# EAGLE design bugfics_0.9 (EAGLE 9.6.2)
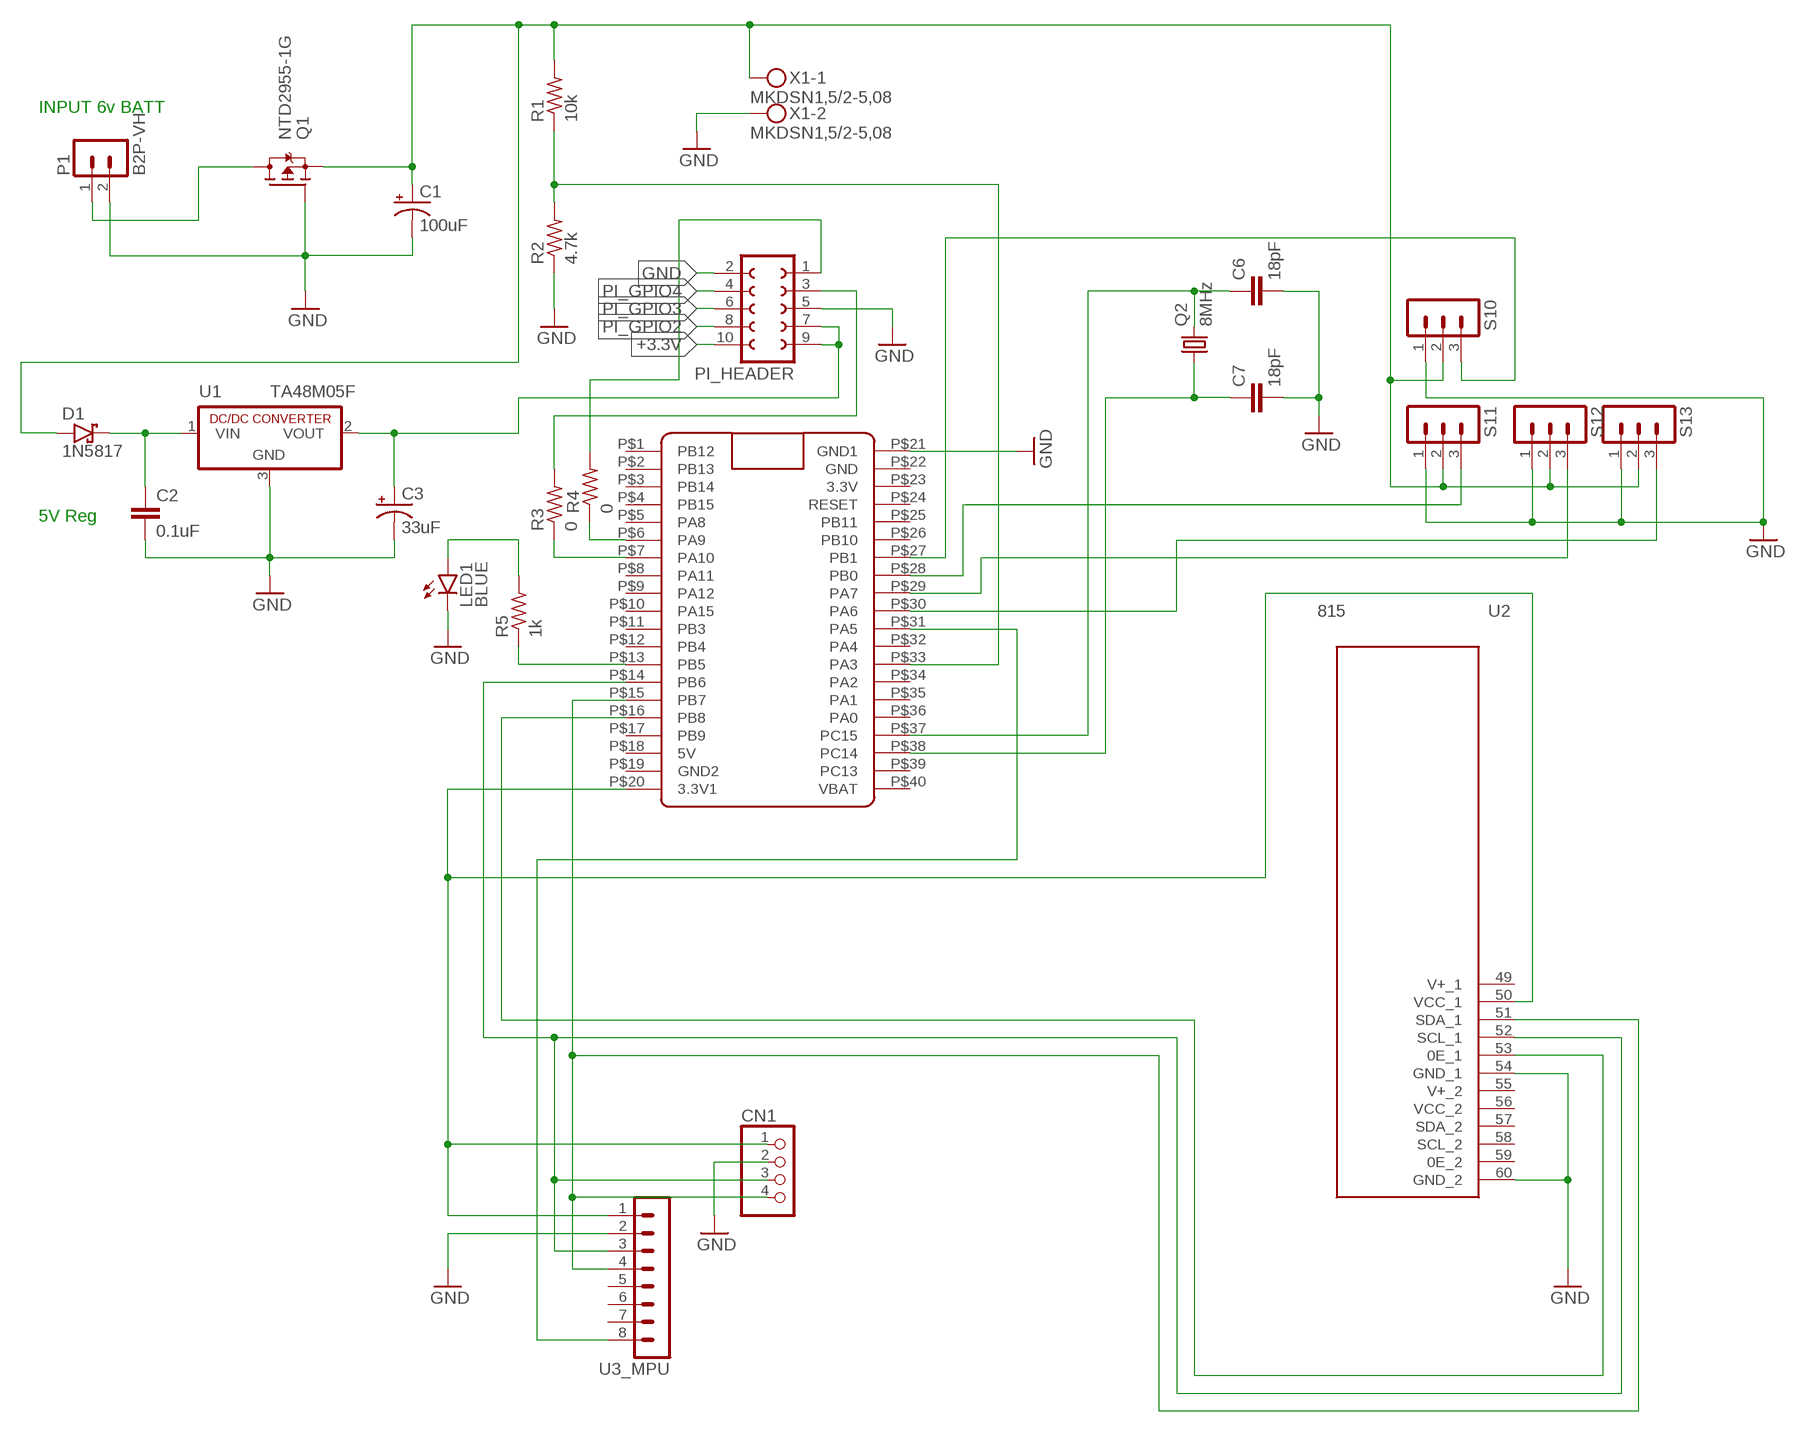
[diagram p0: schematic, sheet 1]

## Parts
C1  100uF  CPOL-USE2-5  [E2-5]
C2  0.1uF  C-EU025-025X050  [C025-025X050]
C3  33uF  CPOL-USE2-5  [E2-5]
C6  18pF  C-EU050-025X075  [C050-025X075]
C7  18pF  C-EU050-025X075  [C050-025X075]
CN1  PINHD-1X4  [1X04]
D1  1N5817  [DO41-3]
LED1  BLUE  LED3MM  [LED3MM]
P1  B2P-VH  [B2P-VH]
PI_HEADER  FE05-2W  [FE05-2W]
Q1  NTD2955-1G  [IPAK_CASE_369D]
Q2  8MHz  CRYSTALHC49S  [HC49/S]
R1  10k  R-US_0207/7  [0207/7]
R2  4.7k  R-US_0207/7  [0207/7]
R3  0  R-US_0207/7  [0207/7]
R4  0  R-US_0207/7  [0207/7]
R5  1k  R-US_0207/7  [0207/7]
S10  MA03-1  [MA03-1]
S11  MA03-1  [MA03-1]
S12  MA03-1  [MA03-1]
S13  MA03-1  [MA03-1]
U1  TA48M05F  [TO252]
U2  815  [815]
U3_MPU  MA08-1  [MA08-1]
U$1  BLUE_PILL  [BLUE_PILL]
X1  MKDSN1,5/2-5,08  [MKDSN1,5/2-5,08]

## Nets
+3.3V [VCC]: PI_HEADER.10
GND [GND]: C1.- C2.2 C3.- C6.2 C7.2 CN1.2 LED1.K(C) P1.2 PI_HEADER.2 PI_HEADER.5 Q1.G R2.1 S10.1 S11.1 S12.1 S13.1 U1.3(GND) U2.54(GND_1) U2.60(GND_2) U3_MPU.2 U$1.P$21(GND1) X1.2
N$2: R3.1 U$1.P$7(PA10)
N$3 [VCC]: P1.1 Q1.D
N$4 [VCC]: C1.+ D1.A Q1.S R1.2 S10.2 S11.2 S12.2 S13.2 X1.1
N$7: R1.1 R2.2 U$1.P$33(PA3)
N$8 [VCC]: C2.1 D1.C U1.1(VIN)
N$9: S13.3 U$1.P$30(PA6)
N$10: S12.3 U$1.P$29(PA7)
N$11: S11.3 U$1.P$28(PB0)
N$12: S10.3 U$1.P$27(PB1)
N$14 [VCC]: CN1.1 U2.50(VCC_1) U3_MPU.1 U$1.P$20(3.3V1)
N$15: PI_HEADER.3 R3.2
N$16 [VCC]: C3.+ PI_HEADER.7 PI_HEADER.9 U1.2(VOUT)
N$17: PI_HEADER.1 R4.2
N$18: R4.1 U$1.P$6(PA9)
N$19: C6.1 Q2.2 U$1.P$37(PC15)
N$20: C7.1 Q2.1 U$1.P$38(PC14)
N$21: CN1.4 U2.51(SDA_1) U3_MPU.4 U$1.P$15(PB7)
N$22: CN1.3 U2.52(SCL_1) U3_MPU.3 U$1.P$14(PB6)
N$23: U2.53(0E_1) U$1.P$16(PB8)
N$24: U3_MPU.8 U$1.P$31(PA5)
N$25: R5.1 U$1.P$13(PB5)
N$27: LED1.A R5.2
PI_GPIO2: PI_HEADER.8
PI_GPIO3: PI_HEADER.6
PI_GPIO4: PI_HEADER.4
Unconnected: U2.49(V+_1) U2.55(V+_2) U2.56(VCC_2) U2.57(SDA_2) U2.58(SCL_2) U2.59(0E_2) U3_MPU.5 U3_MPU.6 U3_MPU.7 U$1.P$1(PB12) U$1.P$2(PB13) U$1.P$3(PB14) U$1.P$4(PB15) U$1.P$5(PA8) U$1.P$8(PA11) U$1.P$9(PA12) U$1.P$10(PA15) U$1.P$11(PB3) U$1.P$12(PB4) U$1.P$17(PB9) U$1.P$18(5V) U$1.P$19(GND2) U$1.P$22(GND) U$1.P$23(3.3V) U$1.P$24(RESET) U$1.P$25(PB11) U$1.P$26(PB10) U$1.P$32(PA4) U$1.P$34(PA2) U$1.P$35(PA1) U$1.P$36(PA0) U$1.P$39(PC13) U$1.P$40(VBAT)

## Notes on the sheet
- INPUT 6v BATT
- 5V Reg

## Library data of the parts
C1 C3 = rcl:CPOL-US: POLARIZED CAPACITOR, American symbol; SPICEPREFIX: C
C2 = rcl:C-EU: CAPACITOR, European symbol; SPICEPREFIX: C
C6 C7 = resistor:C-EU: CAPACITOR, European symbol
CN1 = pinhead:PINHD-1X4: PIN HEADER
D1 = 1N5817:1N5817: Check prices <https://pricing.snapeda.com/parts/1N5817/STMicroelectronics/view-part?ref=eda>; AVAILABILITY: In Stock; DESCRIPTION: 1N5817 Series Low Drop Power 1 A 0.45 V Schottky Rectifier Through Hole - DO-41; MF: STMicroelectronics; MP: 1N5817; PACKAGE: DO-41 STMicroelectronics; PRICE: None; PURCHASE-URL: https://pricing.snapeda.com/search/part/1N5817/?ref=eda
LED1 = led:LED: LED OSRAM: - CHIPLED LG R971, LG N971, LY N971, LG Q971, LY Q971, LO R971, LY R971 LH N974, LH R974 LS Q976, LO Q976, LY Q976 LO Q996 - Hyper CHIPLED LW Q18S LB Q993, LB Q99A, LB R99A - SideLED LS A670, LO A670, LY A670, LG A670, LP A670 LB A673, LV A673, LT A673, LW A673 LH A674 LY A675 LS A676, LA A676, LO A676, LY A676, LW A676 LS A679, LY A679, LG A679 - Hyper Micro SIDELED® LS Y876, LA Y876, LO Y876, LY Y876 LT Y87S - SmartLED LW L88C, LW L88S LB L89C, LB L89S, LG L890 LS L89K, LO L89K, LY L89K LS L896, LA L896, LO L896, LY L896 - TOPLED LS T670, LO T670, LY T670, LG T670, LP T670 LSG T670, LSP T670, LSY T670, LOP T670, LYG T670 LG T671, LOG T671, LSG T671 LB T673, LV T673, LT T673, LW T673 LH T674 LS T676, LA T676, LO T676, LY T676, LB T676, LH T676, LSB T676, LW T676 LB T67C, LV T67C, LT T67C, LS T67K, LO T67K, LY T67K, LW E67C LS E67B, LA E67B, LO E67B, LY E67B, LB E67C, LV E67C, LT E67C LW T67C LS T679, LY T679, LG T679 LS T770, LO T770, LY T770, LG T770, LP T770 LB T773, LV T773, LT T773, LW T773 LH T774 LS E675, LA E675, LY E675, LS T675 LS T776, LA T776, LO T776, LY T776, LB T776 LHGB T686 LT T68C, LB T68C - Hyper Mini TOPLED® LB M676 - Mini TOPLED Santana® LG M470 LS M47K, LO M47K, LY M47K Source: http://www.osram.convergy.de LUXEON: - LUMILED® LXK2-PW12-R00, LXK2-PW12-S00, LXK2-PW14-U00, LXK2-PW14-V00 LXK2-PM12-R00, LXK2-PM12-S00, LXK2-PM14-U00 LXK2-PE12-Q00, LXK2-PE12-R00, LXK2-PE12-S00, LXK2-PE14-T00, LXK2-PE14-U00 LXK2-PB12-K00, LXK2-PB12-L00, LXK2-PB12-M00, LXK2-PB14-N00, LXK2-PB14-P00, LXK2-PB14-Q00 LXK2-PR12-L00, LXK2-PR12-M00, LXK2-PR14-Q00, LXK2-PR14-R00 LXK2-PD12-Q00, LXK2-PD12-R00, LXK2-PD12-S00 LXK2-PH12-R00, LXK2-PH12-S00 LXK2-PL12-P00, LXK2-PL12-Q00, LXK2-PL12-R00 Source: www.luxeon.com KINGBRIGHT: KA-3528ASYC Source: www.kingbright.com
P1 = con-jst-vh:B2P-VH: HEADER
PI_HEADER = con-lsta:FE05-2W: FEMALE HEADER; OC_FARNELL: unknown; OC_NEWARK: unknown
Q1 = NTD2955-1G:NTD2955-1G: Check prices <https://pricing.snapeda.com/parts/NTD2955-1G/ON%20Semiconductor/view-part?ref=eda>; AVAILABILITY: In Stock; DESCRIPTION: P-Channel 60V 12A (Ta) 55W (Tj) Through Hole I-PAK; MF: ON Semiconductor; MP: NTD2955-1G; PACKAGE: TO-251 Fairchild Semiconductor; PRICE: None
Q2 = crystal:CRYSTAL: CRYSTAL; OC_FARNELL: 1667008; OC_NEWARK: unknown
R1-R5 = rcl:R-US_: RESISTOR, American symbol; SPICEPREFIX: R
S10-S13 = con-lstb:MA03-1: PIN HEADER; OC_FARNELL: unknown; OC_NEWARK: unknown
U1 = TA48M05F:TA48M05F
U2 = 815:815: Power Management IC Development Tools PWM/Servo Driver PCA9685 12-bit Source: Datasheet <https://cdn-shop.adafruit.com/datasheets/PCA9685.pdf>; ARROW_PART_NUMBER: 815; ARROW_PRICE-STOCK: https://www.arrow.com/en/products/815/adafruit-industries; DESCRIPTION: Power Management IC Development Tools PWM/Servo Driver PCA9685 12-bit; HEIGHT: mm; MANUFACTURER_NAME: Adafruit; MANUFACTURER_PART_NUMBER: 815; MOUSER_PART_NUMBER: 485-815; MOUSER_PRICE-STOCK: https://www.mouser.co.uk/ProductDetail/Adafruit/815?qs=GURawfaeGuCGKbWyy9179Q%3D%3D
U3_MPU = con-lstb:MA08-1: PIN HEADER; OC_FARNELL: unknown; OC_NEWARK: unknown
U$1 = BluePill:BLUE_PILL
X1 = con-phoenix-508:MKDSN1,5/2-5,08: MKDSN 1,5/ 2-5,08 Printklemme Nennstrom: 13,5 A Nennspannung: 250 V Rastermaß: 5,08 mm Polzahl: 2 Anschlussart: Schraubanschluss Montage: Löten Anschlussrichtung Leiter/Platine: 0 ° Artikelnummer: 1729128 Source: http://eshop.phoenixcontact.com .. 1729128.pdf

## Module POWER
Ports: 

### Library data of the parts

## Net classes
1 GND: width 1 mm
2 VCC: width 1 mm

## Board
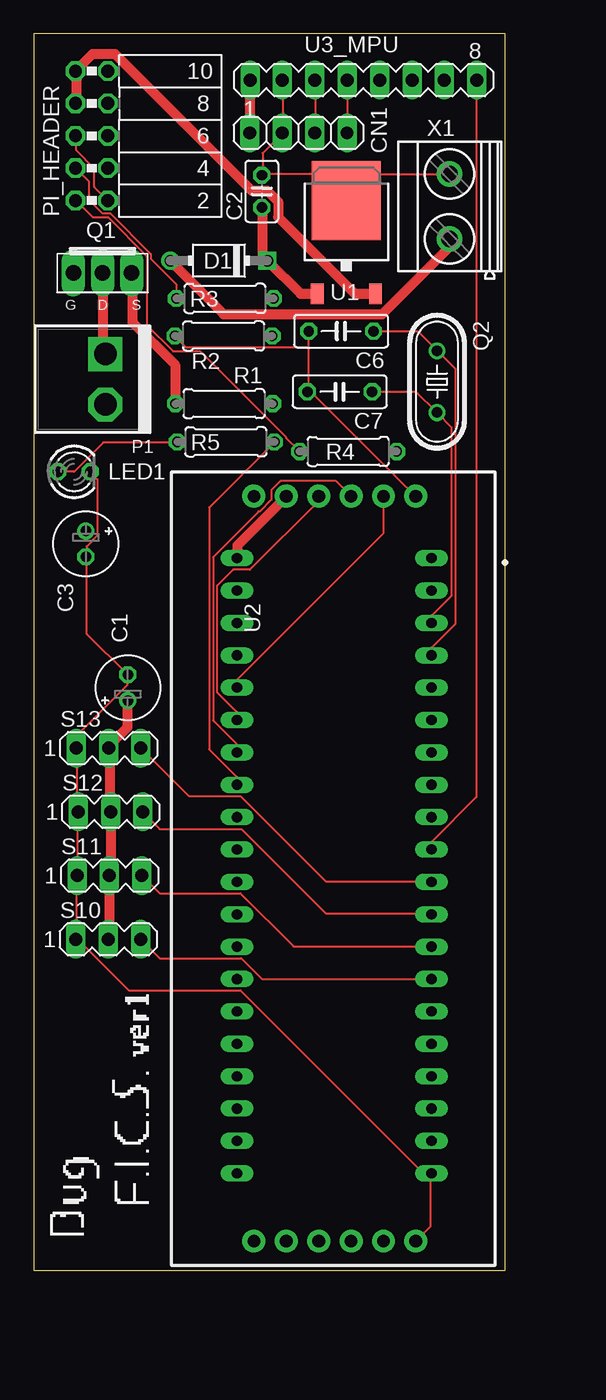
[diagram p1: board, top side]
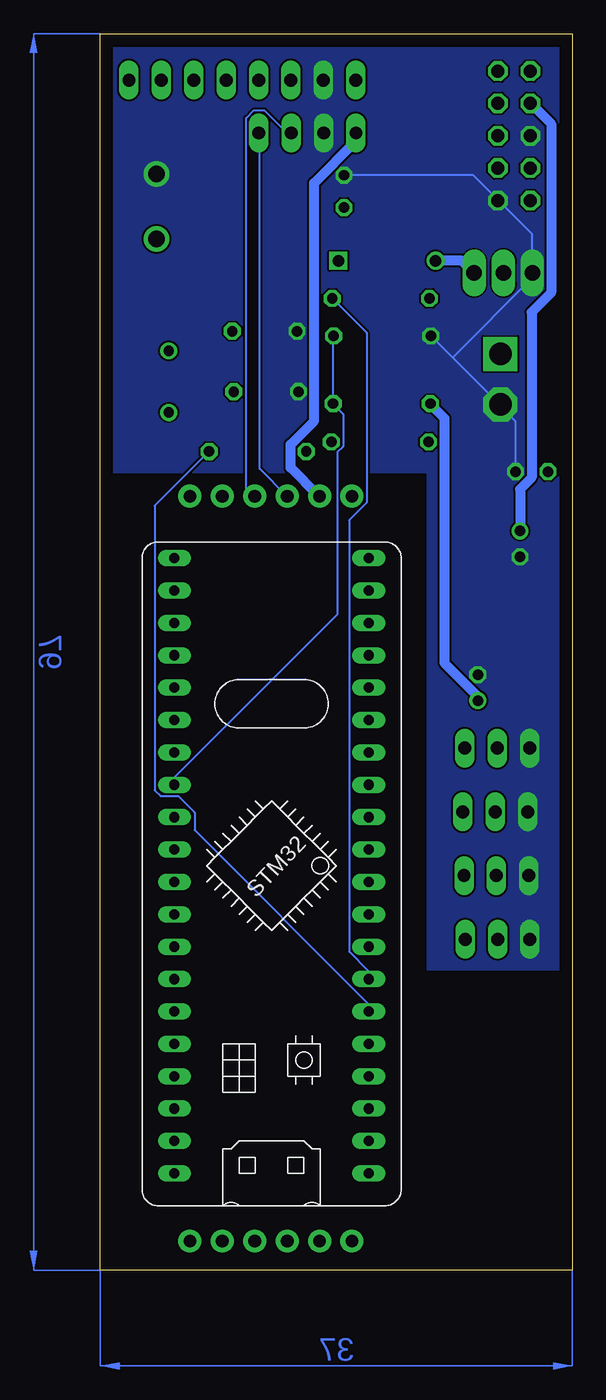
[diagram p2: board, bottom side, seen from below]

Size 37 x 97 mm. Coordinates in mm from the lower left corner, seen from the top.
Outline: 0,0 37,0 37,97 0,97 0,0
Copper layers (1*16): Top 0.035mm / dielectric 1.5mm / Bottom 0.035mm
Design rules "default": minimum track width 6mil, minimum drill 0.35mm, track to track 6mil, track to pad 6mil, pad to pad 6mil, via to via 6mil, smd to smd 6mil, copper to edge 40mil, drill to drill 6mil, minimum pad ring 10mil, minimum via ring 8mil, stop-mask expansion 4mil, vias tented up to drill 0mil, thermal gap 10mil

### Footprints (pad centres in the part's own frame; a part is rotated, then mirrored left to right if it is on the bottom)
E2-5 = drill 0.813 pad 1.27: + -1.016,0 | drill 0.813 pad 1.27 octagon: - 1.016,0
C025-025X050 = drill 0.813 octagon: 1 -1.27,0; 2 1.27,0
C050-025X075 = drill 0.813 octagon: 1 -2.54,0; 2 2.54,0
1X04 = drill 1.016 long: 1 -3.81,0; 2 -1.27,0; 3 1.27,0; 4 3.81,0
DO41-3 = drill 0.9: A 3.81,0 | drill 0.9 square: C -3.81,0
LED3MM = drill 0.813 octagon: A -1.27,0; K 1.27,0
B2P-VH = drill 1.778 square: 1 -1.98,0 | drill 1.778 octagon: 2 1.98,0
FE05-2W = drill 1.016 octagon: 1 -5.08,1.27; 2 -5.08,-1.27; 3 -2.54,1.27; 4 -2.54,-1.27; 5 0,1.27; 6 0,-1.27; 7 2.54,1.27; 8 2.54,-1.27; 9 5.08,1.27; 10 5.08,-1.27
IPAK_CASE_369D = drill 1.219 pad 1.676 long: D 0,0 | drill 1.219 pad 1.778 long: G -2.286,0; S 2.286,0
HC49/S = drill 0.813: 1 -2.413,0; 2 2.413,0
0207/7 = drill 0.813 octagon: 1 -3.81,0; 2 3.81,0
MA03-1 = drill 1.016 long: 1 -2.54,0; 2 0,0; 3 2.54,0
TO252 = smd 1 x 1.6: 1 -2.28,-4.8; 2 2.28,-4.8 | smd 5.4 x 6.2: 3 0,2.5
815 = drill 1 pad 1.8: 49 1.91,6.48; 50 1.91,9.02; 51 1.91,11.56; 52 1.91,14.1; 53 1.91,16.64; 54 1.91,19.18; 55 60.33,6.48; 56 60.33,9.02; 57 60.33,11.56; 58 60.33,14.1; 59 60.33,16.64; 60 60.33,19.18
MA08-1 = drill 1.016 long: 1 -8.89,0; 2 -6.35,0; 3 -3.81,0; 4 -1.27,0; 5 1.27,0; 6 3.81,0; 7 6.35,0; 8 8.89,0
BLUE_PILL = drill 0.8 long: P$1 -7.62,15.24; P$2 -7.62,12.7; P$3 -7.62,10.16; P$4 -7.62,7.62; P$5 -7.62,5.08; P$6 -7.62,2.54; P$7 -7.62,0; P$8 -7.62,-2.54; P$9 -7.62,-5.08; P$10 -7.62,-7.62; P$11 -7.62,-10.16; P$12 -7.62,-12.7; P$13 -7.62,-15.24; P$14 -7.62,-17.78; P$15 -7.62,-20.32; P$16 -7.62,-22.86; P$17 -7.62,-25.4; P$18 -7.62,-27.94; P$19 -7.62,-30.48; P$20 -7.62,-33.02; P$21 7.62,15.24; P$22 7.62,12.7; P$23 7.62,10.16; P$24 7.62,7.62; P$25 7.62,5.08; P$26 7.62,2.54; P$27 7.62,0; P$28 7.62,-2.54; P$29 7.62,-5.08; P$30 7.62,-7.62; P$31 7.62,-10.16; P$32 7.62,-12.7; P$33 7.62,-15.24; P$34 7.62,-17.78; P$35 7.62,-20.32; P$36 7.62,-22.86; P$37 7.62,-25.4; P$38 7.62,-27.94; P$39 7.62,-30.48; P$40 7.62,-33.02
MKDSN1,5/2-5,08 = drill 1.3 pad 2: 1 -2.561,0.025; 2 2.519,0.025

### Placement (x,y rotation side)
C1  7.4,45.69 90 top
C2  17.9,84.62 90 top
C3  4.1,56.97 270 top
C6  24.12,73.65 180 top
C7  24.01,68.9 180 top
CN1  20.77,89.2 0 top
D1  14.53,79.18 180 top
LED1  3.18,62.63 0 top
P1  5.63,69.88 270 top
PI_HEADER  4.56,88.98 90 top
Q1  5.41,78.22 0 top
Q2  31.64,69.69 90 top
R1  14.94,67.97 180 top
R2  14.9,73.28 0 top
R3  15.01,76.22 180 top
R4  24.67,64.22 180 top
R5  15.08,64.97 180 top
S10  5.86,25.95 0 top
S11  5.95,30.95 0 top
S12  6.04,35.95 0 top
S13  5.88,40.95 0 top
U1  24.53,81.38 0 top
U2  10.8,62.61 270 top
U3_MPU  25.87,93.35 0 top
U$1  23.58,22.83 180 bottom
X1  32.64,83.46 90 top

### Tracks (layer width: path | path; a pad name or v marks a point on that pad's centre or on a via)
GND
  Top 0.152: U3_MPU.2 19.56,93.34 19.56,89.23 CN1.2 19.49,89.15 17.96,87.63 17.96,85.95 C2.2 18.04,85.95 22.46,85.95 24.52,83.9 U1.3 24.59,83.9 26.65,85.95 32.59,85.95 X1.2 | 21.54,72.39 21.54,73.61 C6.2 | 21.54,72.39 21.54,68.96 C7.2 21.62,68.96 21.7,68.96 29.93,60.73 U2.54 | PI_HEADER.5 3.33,88.92 3.33,87.86 4.78,86.41 4.78,84.96 5.77,83.97 PI_HEADER.2 | LED1.K 4.47,62.56 5.01,62.03 5.01,57.61 4.17,56.77 4.17,56.01 C3.- 4.17,55.93 4.17,49.91 7.37,46.71 C1.- 7.37,46.63 7.37,45.95 3.41,41.99 3.41,41 S13.1 3.41,40.92 3.41,35.89 S12.1 3.48,35.89 3.48,31.01 S11.1 3.41,30.94 3.33,30.86 3.33,25.98 S10.1 3.41,25.98 7.45,21.95 16.21,21.95 30.61,7.54 31.07,7.54 U$1.P$21 31.14,7.54 31.14,3.43 30,2.29 U2.60 | 21.54,72.39 11.94,72.39 11.1,73.23 R2.1
  Bottom 0.152: 9.39,71.59 5.69,67.89 P1.2 5.69,67.82 4.47,66.6 4.47,62.64 LED1.K | 9.39,71.59 11.03,73.23 R2.1 | 9.39,71.59 3.18,77.8 3.18,78.18 Q1.G 3.18,78.26 3.18,81.31 5.77,83.9 PI_HEADER.2 5.85,83.97 7.75,85.88 17.89,85.88 C2.2
  pour Bottom (isolate 0.051, no thermals): 0.39,96.52 36.56,96.52 36.56,62.79 36.56,62.59 11.36,62.59 11.36,23.57 10.75,23.57 0.18,23.57 0.18,24.18 0.18,96.52
N$2
  Bottom 0.152: U$1.P$7 15.98,22.86 15.98,23.47 17.5,24.99 17.5,58.83 16.13,60.2 16.13,73.53 18.8,76.2 R3.1
N$3
  Top 0.8: Q1.D 5.47,78.18 5.47,72.08 5.62,71.93 P1.1
N$4
  Top 0.8: C1.+ 7.37,44.65 7.37,42.6 5.92,41.15 5.92,41 S13.2 6,40.62 6,36.35 S12.2 6.08,35.89 6.08,31.32 S11.2 5.92,30.94 5.92,25.98 S10.2 | R1.2 11.1,67.97 11.1,71.02 7.75,74.37 7.75,78.18 Q1.S | X1.1 32.59,80.85 32.59,80.24 27.34,74.98 14.91,74.98 D1.A
  Bottom 0.8: D1.A 10.65,79.17 8.67,79.17 7.75,78.26 Q1.S | C1.+ 7.45,44.73 7.45,45.03 10.04,47.62 10.04,66.83 11.1,67.89 R1.2
N$7
  Bottom 0.152: U$1.P$33 31.14,38.1 31.14,38.71 18.42,51.44 18.42,64.16 17.96,64.62 17.96,67.13 18.72,67.89 R1.1 18.72,67.97 18.72,73.23 R2.2
N$8
  Top 0.8: U1.1 22.23,76.58 20.93,76.58 D1.C 18.04,79.48 17.96,79.55 17.96,83.29 C2.1
N$9
  Top 0.152: U$1.P$30 31.14,30.48 22.91,30.48 16.21,37.19 12.17,37.19 8.44,40.92 S13.3
N$10
  Top 0.152: U$1.P$29 31.14,27.96 22.91,27.96 16.29,34.59 9.88,34.59 8.59,35.89 S12.3
N$11
  Top 0.152: U$1.P$28 31.14,25.38 20.4,25.38 16.21,29.57 9.88,29.57 8.51,30.94 S11.3
N$12
  Top 0.152: U$1.P$27 31.14,22.86 17.89,22.86 16.29,24.46 9.88,24.46 8.44,25.91 S10.3
N$14
  Top 0.8: CN1.1 16.97,89.23 U3_MPU.1 | U$1.P$20 15.98,55.85 15.98,56.84 19.79,60.66 U2.50
  Bottom 0.8: CN1.1 16.97,89.15 16.97,88.54 20.25,85.27 20.25,66.6 22.08,64.77 22.08,62.94 19.87,60.73 U2.50
N$15
  Top 0.152: R3.2 11.18,76.28 11.18,77.34 9.2,79.32 9.2,79.7 6,82.91 5.39,82.91 4.32,83.97 4.32,85.42 3.33,86.41 PI_HEADER.3
N$16
  Top 0.8: U1.2 25.2,76.58 19.18,82.6 19.18,83.82 18.34,84.66 17.12,84.66 6.38,95.4 4.63,95.4 3.33,94.11 PI_HEADER.9 3.33,93.73 3.33,91.59 PI_HEADER.7
  Bottom 0.8: C3.+ 4.09,61.27 3.18,62.18 3.18,75.13 1.66,76.66 1.66,89.92 3.26,91.52 PI_HEADER.7
N$17
  Top 0.152: R4.2 20.86,64.24 19.79,65.3 19.79,65.38 13.09,72.08 10.95,72.08 8.89,74.14 8.89,79.55 5.85,82.6 4.63,82.6 3.33,83.9 PI_HEADER.1
N$18
  Bottom 0.152: U$1.P$6 15.98,20.34 15.98,20.88 29.62,34.52 29.62,35.89 30.92,37.19 32.29,37.19 32.75,37.64 32.75,59.97 28.55,64.16 R4.1
N$19
  Top 0.152: U$1.P$37 31.22,48.23 31.22,48.84 33.05,50.67 33.05,70.71 31.68,72.08 Q2.2 31.6,72.16 30.15,73.61 26.73,73.61 C6.1
N$20
  Top 0.152: U$1.P$38 31.22,50.83 31.22,51.36 32.75,52.88 32.75,66.14 31.68,67.21 Q2.1 31.6,67.28 30,68.89 26.57,68.89 C7.1
N$21
  Top 0.152: CN1.4 24.59,89.23 U3_MPU.4 | U$1.P$15 15.9,43.2 15.9,43.81 14.38,45.34 14.38,53.65 15.68,54.94 16.97,54.94 22.31,60.27 22.31,60.66 U2.51
  Bottom 0.152: CN1.4 24.52,89.15 24.52,62.87 22.38,60.73 U2.51
N$22
  Top 0.152: CN1.3 22.08,89.23 22.08,93.34 U3_MPU.3 | U$1.P$14 15.9,40.62 15.9,41.3 14.08,43.13 14.08,55.93 17.66,59.51 17.73,59.51 18.65,60.43 18.65,61.19 19.33,61.87 23.75,61.87 24.9,60.73 U2.52
  Bottom 0.152: CN1.3 22.08,89.23 22.38,89.23 24.13,90.98 24.97,90.98 25.58,90.37 25.58,61.34 24.97,60.73 U2.52
N$23
  Top 0.152: U$1.P$16 15.98,45.72 15.98,46.33 27.41,57.76 27.41,60.66 U2.53
N$24
  Top 0.152: U$1.P$31 31.22,32.99 31.22,33.6 34.73,37.11 34.73,93.34 U3_MPU.8
N$25
  Top 0.152: U$1.P$13 15.9,38.1 15.9,38.71 13.77,40.84 13.77,59.82 18.88,64.92 R5.1
N$27
  Top 0.152: LED1.A 1.96,62.64 3.18,62.64 5.47,64.92 11.26,64.92 R5.2
(copper drawn outside any net)
  shapes: Bottom area x2